# EasyEDA Pro project AcRemote.eprj

# Schematic Schematic1
Create Date: 2023-08-15; Page Name: P1; Project Name: AcRemote; Schematic Name: Schematic1; Update Date: 2023-08-17; Company: EasyEDA.com; Drawed: EasyEDA Pro; Page Size: A4; Part Number: JLCPCB-002; Reviewed: EasyEDA Pro; Version: V0.1
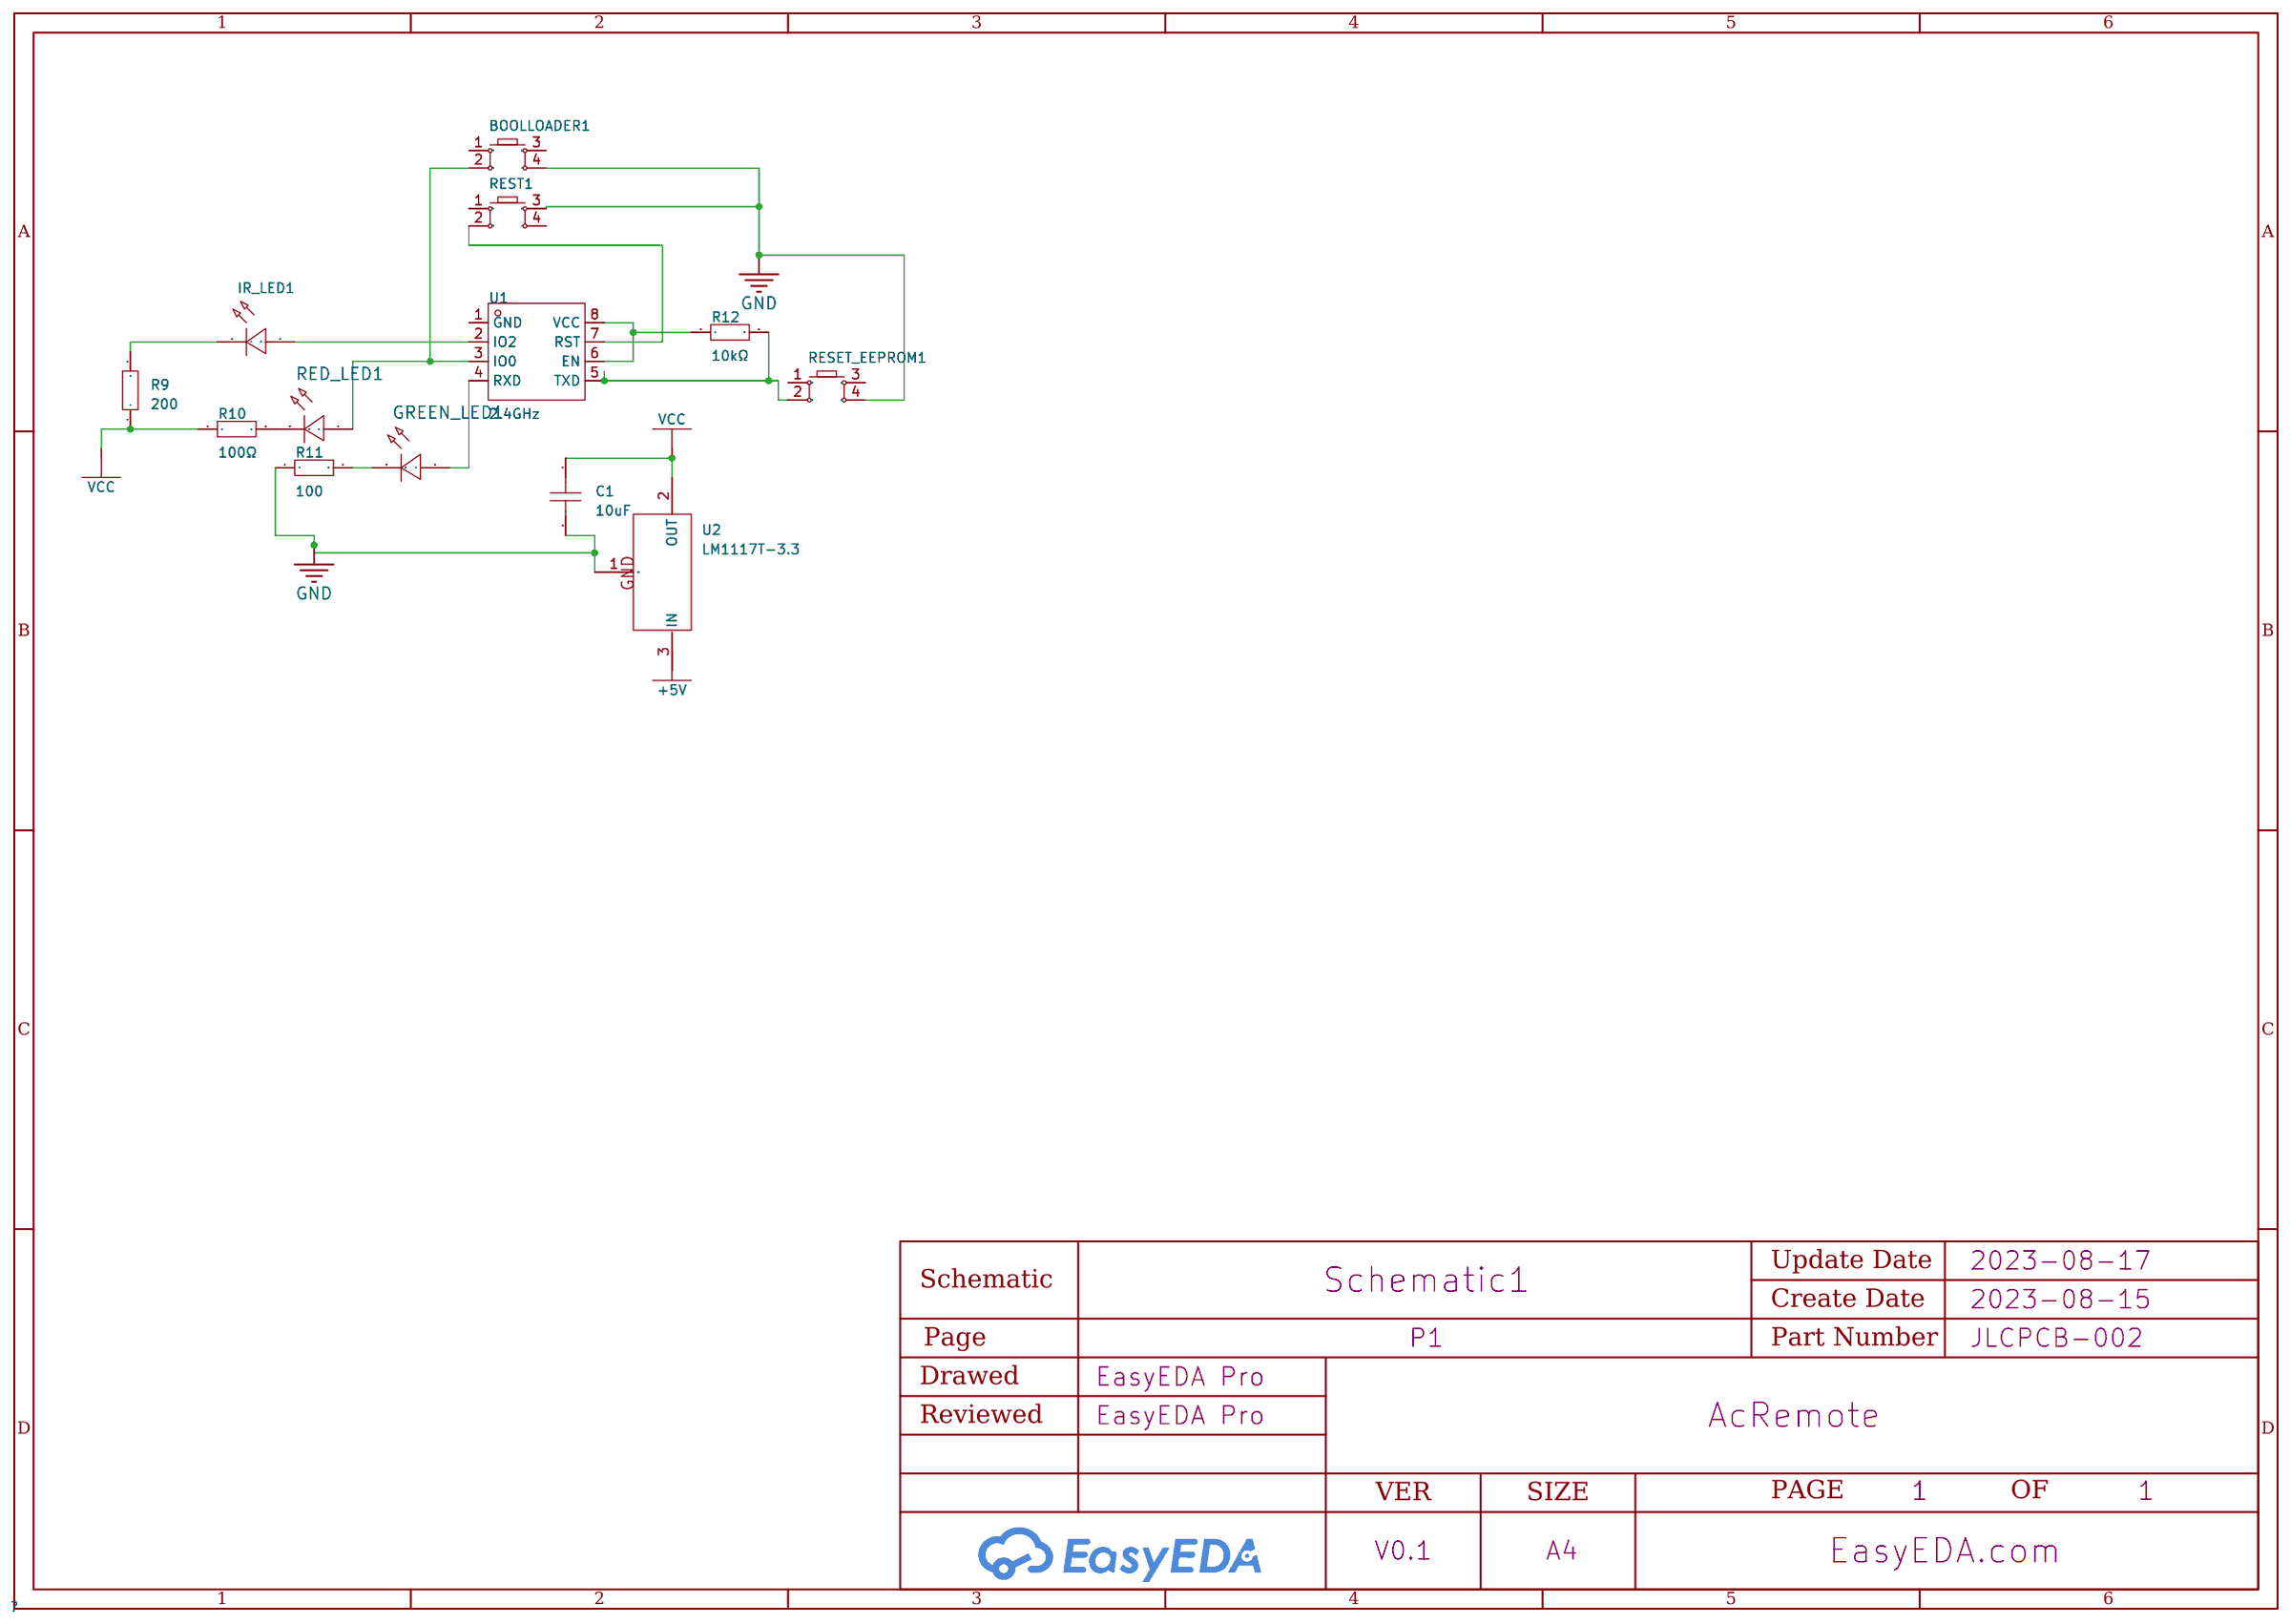
[diagram p0: schematic sheet]

## Parts
BOOLLOADER1  -  [KEY-TH_4P-L6.0-W6.0-P3.90-LS6.5]
C1  10uF  [C0201]
GREEN_LED1  -  [LED0402-RD_YELLOW]
IR_LED1  -  [LED-TH_BD3.0-P2.54-FD]
R9  200  [RES-TH_BD1.8-L3.2-P7.20-D0.4]
R10  100Ω  [RES-TH_BD1.8-L3.2-P7.20-D0.4]
R11  100  [RES-TH_BD1.8-L3.2-P7.20-D0.4]
R12  10kΩ  [RES-TH_BD1.8-L3.2-P7.20-D0.4]
RED_LED1  -  [LED0402-RD_YELLOW]
RESET_EEPROM1  -  [KEY-TH_4P-L6.0-W6.0-P3.90-LS6.5]
REST1  -  [KEY-TH_4P-L6.0-W6.0-P3.90-LS6.5]
U1  2.4GHz  [WIFIM-TH_8P-L24.7-W14.4-P2.54]
U2  LM1117T-3.3  [TO-220-3_L10.0-W4.5-P2.54-L]

## Library data of the parts
BOOLLOADER1 RESET_EEPROM1 REST1 = Key_TH_6x6x4.5: Supplier Footprint: Through
C1 = CAP_0201: Supplier Footprint: 0201
GREEN_LED1 RED_LED1 = LED_0402-R: Supplier Footprint: 0402
IR_LED1 = LED_TH-R_3mm: Supplier Footprint: Through
R9-R12 = Res_AXIAL-1/8W: Supplier Footprint: Through
U1 = ESP-01S_C503582: Frequency:2.4GHz Output Power:16dBm Output Power:16dBm Core Processor:ESP32 Support Interface:GPIO；UART；PWM Antenna Type:PCB 板载天线 Wireless Standard:802.11b/g/n Operating Voltage:3V~3.6V Operating Voltage:3V~3.6V Receive  Current:56mA Send  Current:170mA S; LCSC Part Name: 完整的802.11b/g/nWi-FiSoC模块; Supplier Part: C503582; Manufacturer: Ai-Thinker(安信可); Manufacturer Part: ESP-01S; JLCPCB Part Class: Extended Part; Datasheet: https://atta.szlcsc.com/upload/public/pdf/source/20200407/C503582_1139AF8FB42E05635FA0089E1752A536.pdf; Supplier: LCSC; Output Power: 16dBm; Core Processor: ESP32; Support Interface: GPIO；UART；PWM; Antenna Type: PCB 板载天线; Wireless Standard: 802.11b/g/n; Operating Voltage: 3V~3.6V; Receive  Current: 56mA; Send  Current: 170mA; Sensitivity: -90dBm; Operating Temperature: -20℃~+70℃
U2 = LM1117T-3.3: Output Type:-; Supplier Part: C498321; Manufacturer: HGSEMI(华冠); Supplier Footprint: TO-220; JLCPCB Part Class: Extended Part; Datasheet: https://atta.szlcsc.com/upload/public/pdf/source/20201010/C498321_A78C1BC049E2A9ED534DA1D4E5758433.pdf; Supplier: LCSC

## Nets
+5V: U2.3(IN)
GND: BOOLLOADER1.4 C1.2 R11.1 RESET_EEPROM1.4 REST1.3 U2.1(GND)
VCC: C1.1 R9.1 R10.1 U2.2(OUT)
Net-(BOOLLOADER1-2): BOOLLOADER1.2 RED_LED1.1(A) U1.3(IO0)
Net-(GREEN_LED1-1): GREEN_LED1.1(A) U1.4(RXD)
Net-(GREEN_LED1-2): GREEN_LED1.2(C) R11.2
Net-(IR_LED1-1): IR_LED1.1(C) U1.2(IO2)
Net-(IR_LED1-2): IR_LED1.2(A) R9.2
Net-(R10-2): R10.2 RED_LED1.2(C)
Net-(R12-1): R12.1 U1.6(EN) U1.8(VCC)
Net-(R12-2): R12.2 RESET_EEPROM1.2 U1.5(TXD)
Net-(REST1-2): REST1.2 U1.7(RST)

Not connected (* = marked no-connect by the designer): BOOLLOADER1 1 3; RESET_EEPROM1 1 3; REST1 1 4; U1 1(GND)

# Schematic Schematic2
Create Date: 2023-10-16; Page Name: P1; Project Name: AcRemote; Schematic Name: Schematic2; Update Date: 2023-10-21; Company: EasyEDA.com; Drawed: EasyEDA Pro; Page Size: A4; Part Number: JLCPCB-002; Reviewed: EasyEDA Pro; Version: V0.1
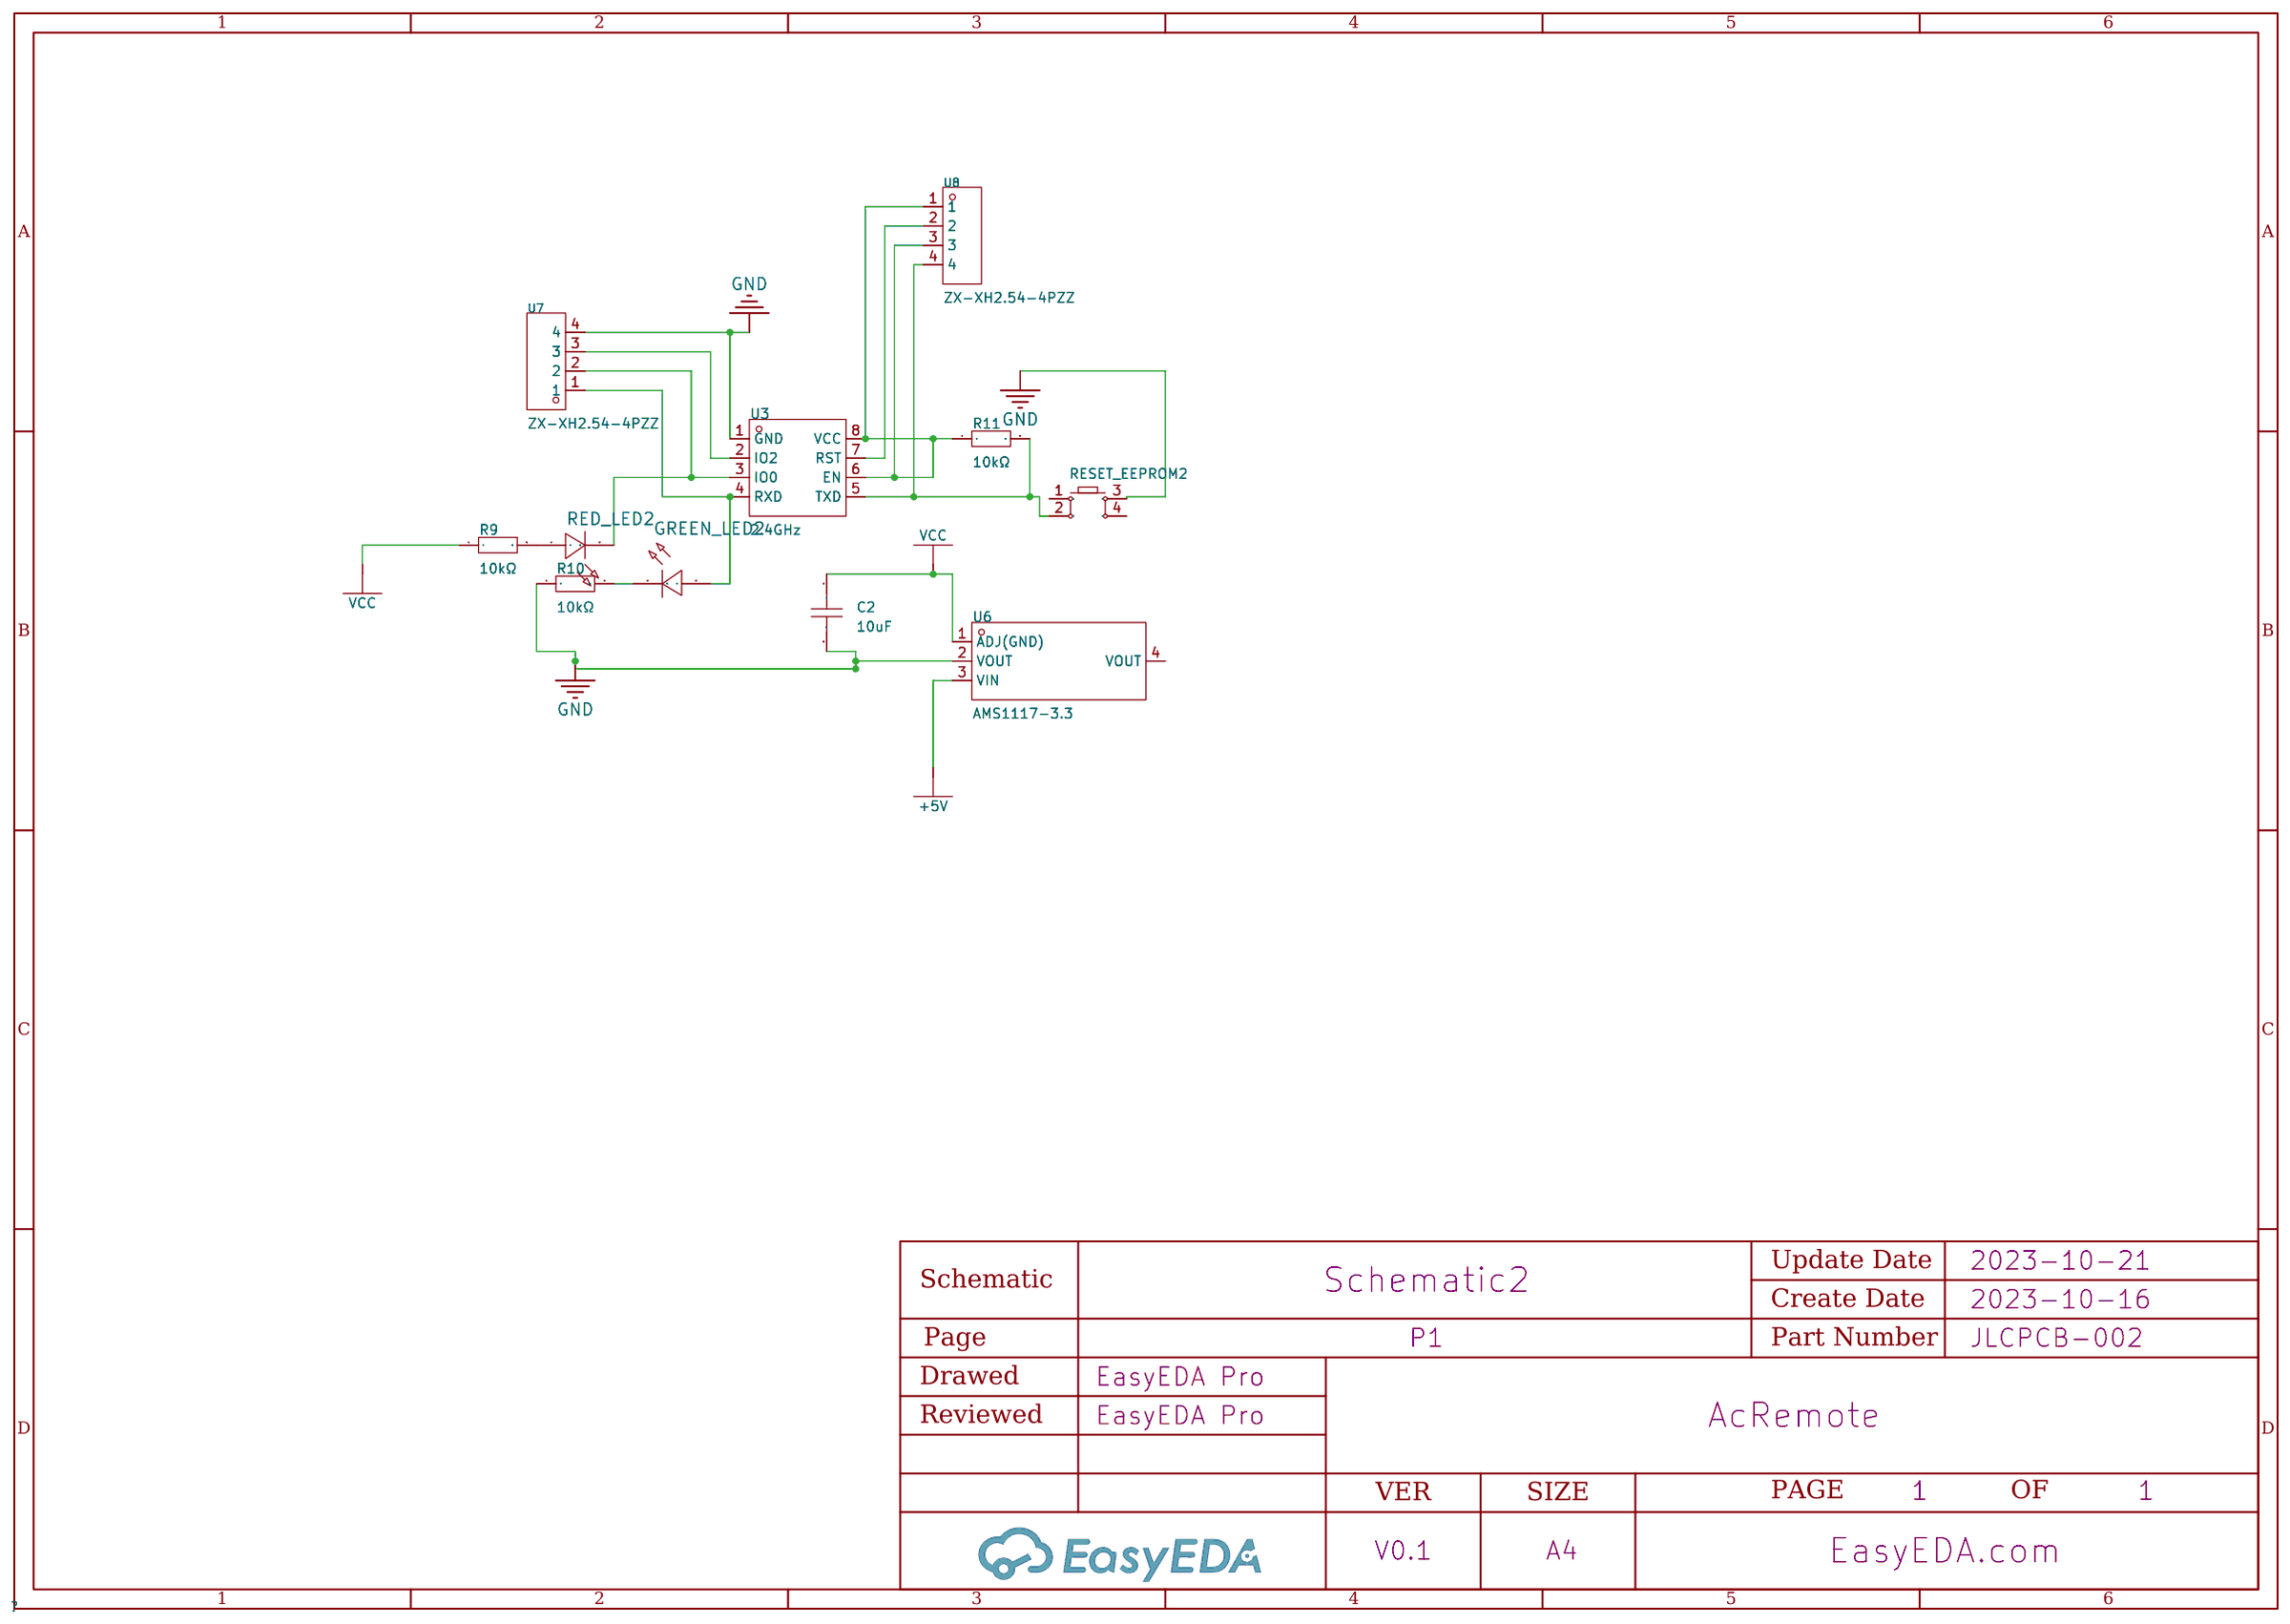
[diagram p1: schematic sheet]

## Parts
C2  10uF  [CAP-TH_BD4.0-P2.50-D0.6-FD]
GREEN_LED2  -  [LED-TH_BD6.0-P2.54_UV415J25X-5]
R9  10kΩ  [R_AXIAL-0.4]
R10  10kΩ  [R_AXIAL-0.4]
R11  10kΩ  [R_AXIAL-0.4]
RED_LED2  -  [LED-TH_BD6.0-P2.54_UV415J25X-5]
RESET_EEPROM2  -  [KEY-TH_4P-L6.0-W6.0-P3.90-LS6.5]
U3  2.4GHz  [WIFIM-TH_8P-L24.7-W14.4-P2.54]
U6  AMS1117-3.3  [SOT-223-3_L6.5-W3.4-P2.30-LS7.0-BR]
U7  ZX-XH2.54-4PZZ  [CONN-TH_4P-P2.50_4PIN]
U8  ZX-XH2.54-4PZZ  [CONN-TH_4P-P2.50_4PIN]

## Library data of the parts
C2 = CAP_0201: Supplier Footprint: 0201
GREEN_LED2 RED_LED2 = LED_0402-R: Supplier Footprint: 0402
R9-R11 = Res_AXIAL-1/4W: Supplier Footprint: Through
RESET_EEPROM2 = Key_TH_6x6x4.5: Supplier Footprint: Through
U3 = ESP-01S_C503582: Frequency:2.4GHz Output Power:16dBm Output Power:16dBm Core Processor:ESP32 Support Interface:GPIO；UART；PWM Antenna Type:PCB 板载天线 Wireless Standard:802.11b/g/n Operating Voltage:3V~3.6V Operating Voltage:3V~3.6V Receive  Current:56mA Send  Current:170mA S; LCSC Part Name: 完整的802.11b/g/nWi-FiSoC模块; Supplier Part: C503582; Manufacturer: Ai-Thinker(安信可); Manufacturer Part: ESP-01S; JLCPCB Part Class: Extended Part; Datasheet: https://atta.szlcsc.com/upload/public/pdf/source/20200407/C503582_1139AF8FB42E05635FA0089E1752A536.pdf; Supplier: LCSC; Output Power: 16dBm; Core Processor: ESP32; Support Interface: GPIO；UART；PWM; Antenna Type: PCB 板载天线; Wireless Standard: 802.11b/g/n; Operating Voltage: 3V~3.6V; Receive  Current: 56mA; Send  Current: 170mA; Sensitivity: -90dBm; Operating Temperature: -20℃~+70℃
U6 = AMS1117-3.3_C2891839: Output Type: Output Polarity:Positive Number of Outputs:1 Maximum Input Voltage:18V Output Voltage:3.3V~3.3V Output Voltage:3.3V~3.3V Dropout Voltage:1.3V@(1A) Output Current:1A Power Supply Rejection Ratio (PSRR):60dB@(120Hz) Operating Temperature:±150℃@; LCSC Part Name: 正 Vin=18V Vout=3.3V 1A 60dB@(120Hz); Supplier Part: C2891839; Manufacturer: YONGYUTAI(永裕泰); Supplier Footprint: SOT-223-3; JLCPCB Part Class: Extended Part; Datasheet: https://atta.szlcsc.com/upload/public/pdf/source/20210901/A75ADDE6A17DEE0002F2A58A8D1F3634.pdf; Supplier: LCSC; Output Polarity: Positive; Number of Outputs: 1; Maximum Input Voltage: 18V; Output Voltage: 3.3V~3.3V; Dropout Voltage: 1.3V@(1A); Output Current: 1A; Power Supply Rejection Ratio (PSRR): 60dB@(120Hz); Operating Temperature: ±150℃@(Tj)
U7 U8 = ZX-XH2.54-4PZZ: Reference Series:XH Pitch:2.54mm Pins Structure:1x4P Number of Rows:1 Number of PINs Per Row:4 Row Spacing:- Gender:公型插针 Mounting Style:Straight Current Rating (Max):3A Contact Material:Brass Contact Plating:Tin Operating Temperature Range:-25℃~+85℃ Opera; LCSC Part Name: XH 2.54mm 1x4P 直插; Supplier Part: C7429634; Manufacturer: Megastar(兆星); Supplier Footprint: 插件,P=2.54mm; JLCPCB Part Class: Extended Part; Datasheet: https://atta.szlcsc.com/upload/public/pdf/source/20230619/B529A2163E0159A644AB3383D208FB03.pdf; Supplier: LCSC; Reference Series: XH; Pitch: 2.54mm; Pins Structure: 1x4P; Number of Rows: 1; Number of PINs Per Row: 4; Gender: 公型插针; Mounting Style: Straight; Current Rating (Max): 3A; Contact Material: Brass; Contact Plating: Tin; Operating Temperature Range: -25℃~+85℃; Welding Temperature (Max): 260℃

## Nets
+5V: U6.3(VIN)
GND: C2.2 R10.1 RESET_EEPROM2.3 U3.1(GND) U6.2(VOUT) U7.4
VCC: C2.1 R9.1 U6.1(ADJ(GND))
$1N399: GREEN_LED2.2(C) R10.2
$1N1476: R9.2 RED_LED2.1(A)
$1N1781: U3.7(RST) U8.2
$1N1786: R11.1 U3.6(EN) U3.8(VCC) U8.1 U8.3
$1N1799: R11.2 RESET_EEPROM2.2 U3.5(TXD) U8.4
$1N1820: U3.2(IO2) U7.3
$1N1825: RED_LED2.2(C) U3.3(IO0) U7.2
$1N1834: GREEN_LED2.1(A) U3.4(RXD) U7.1

Not connected (* = marked no-connect by the designer): RESET_EEPROM2 1 4; U6 4(VOUT)

# Schematic Schematic2_1
Create Date: 2023-10-16; Page Name: P1; Project Name: AcRemote; Schematic Name: Schematic2; Update Date: 2023-10-19; Company: EasyEDA.com; Drawed: EasyEDA Pro; Page Size: A4; Part Number: JLCPCB-002; Reviewed: EasyEDA Pro; Version: V0.1
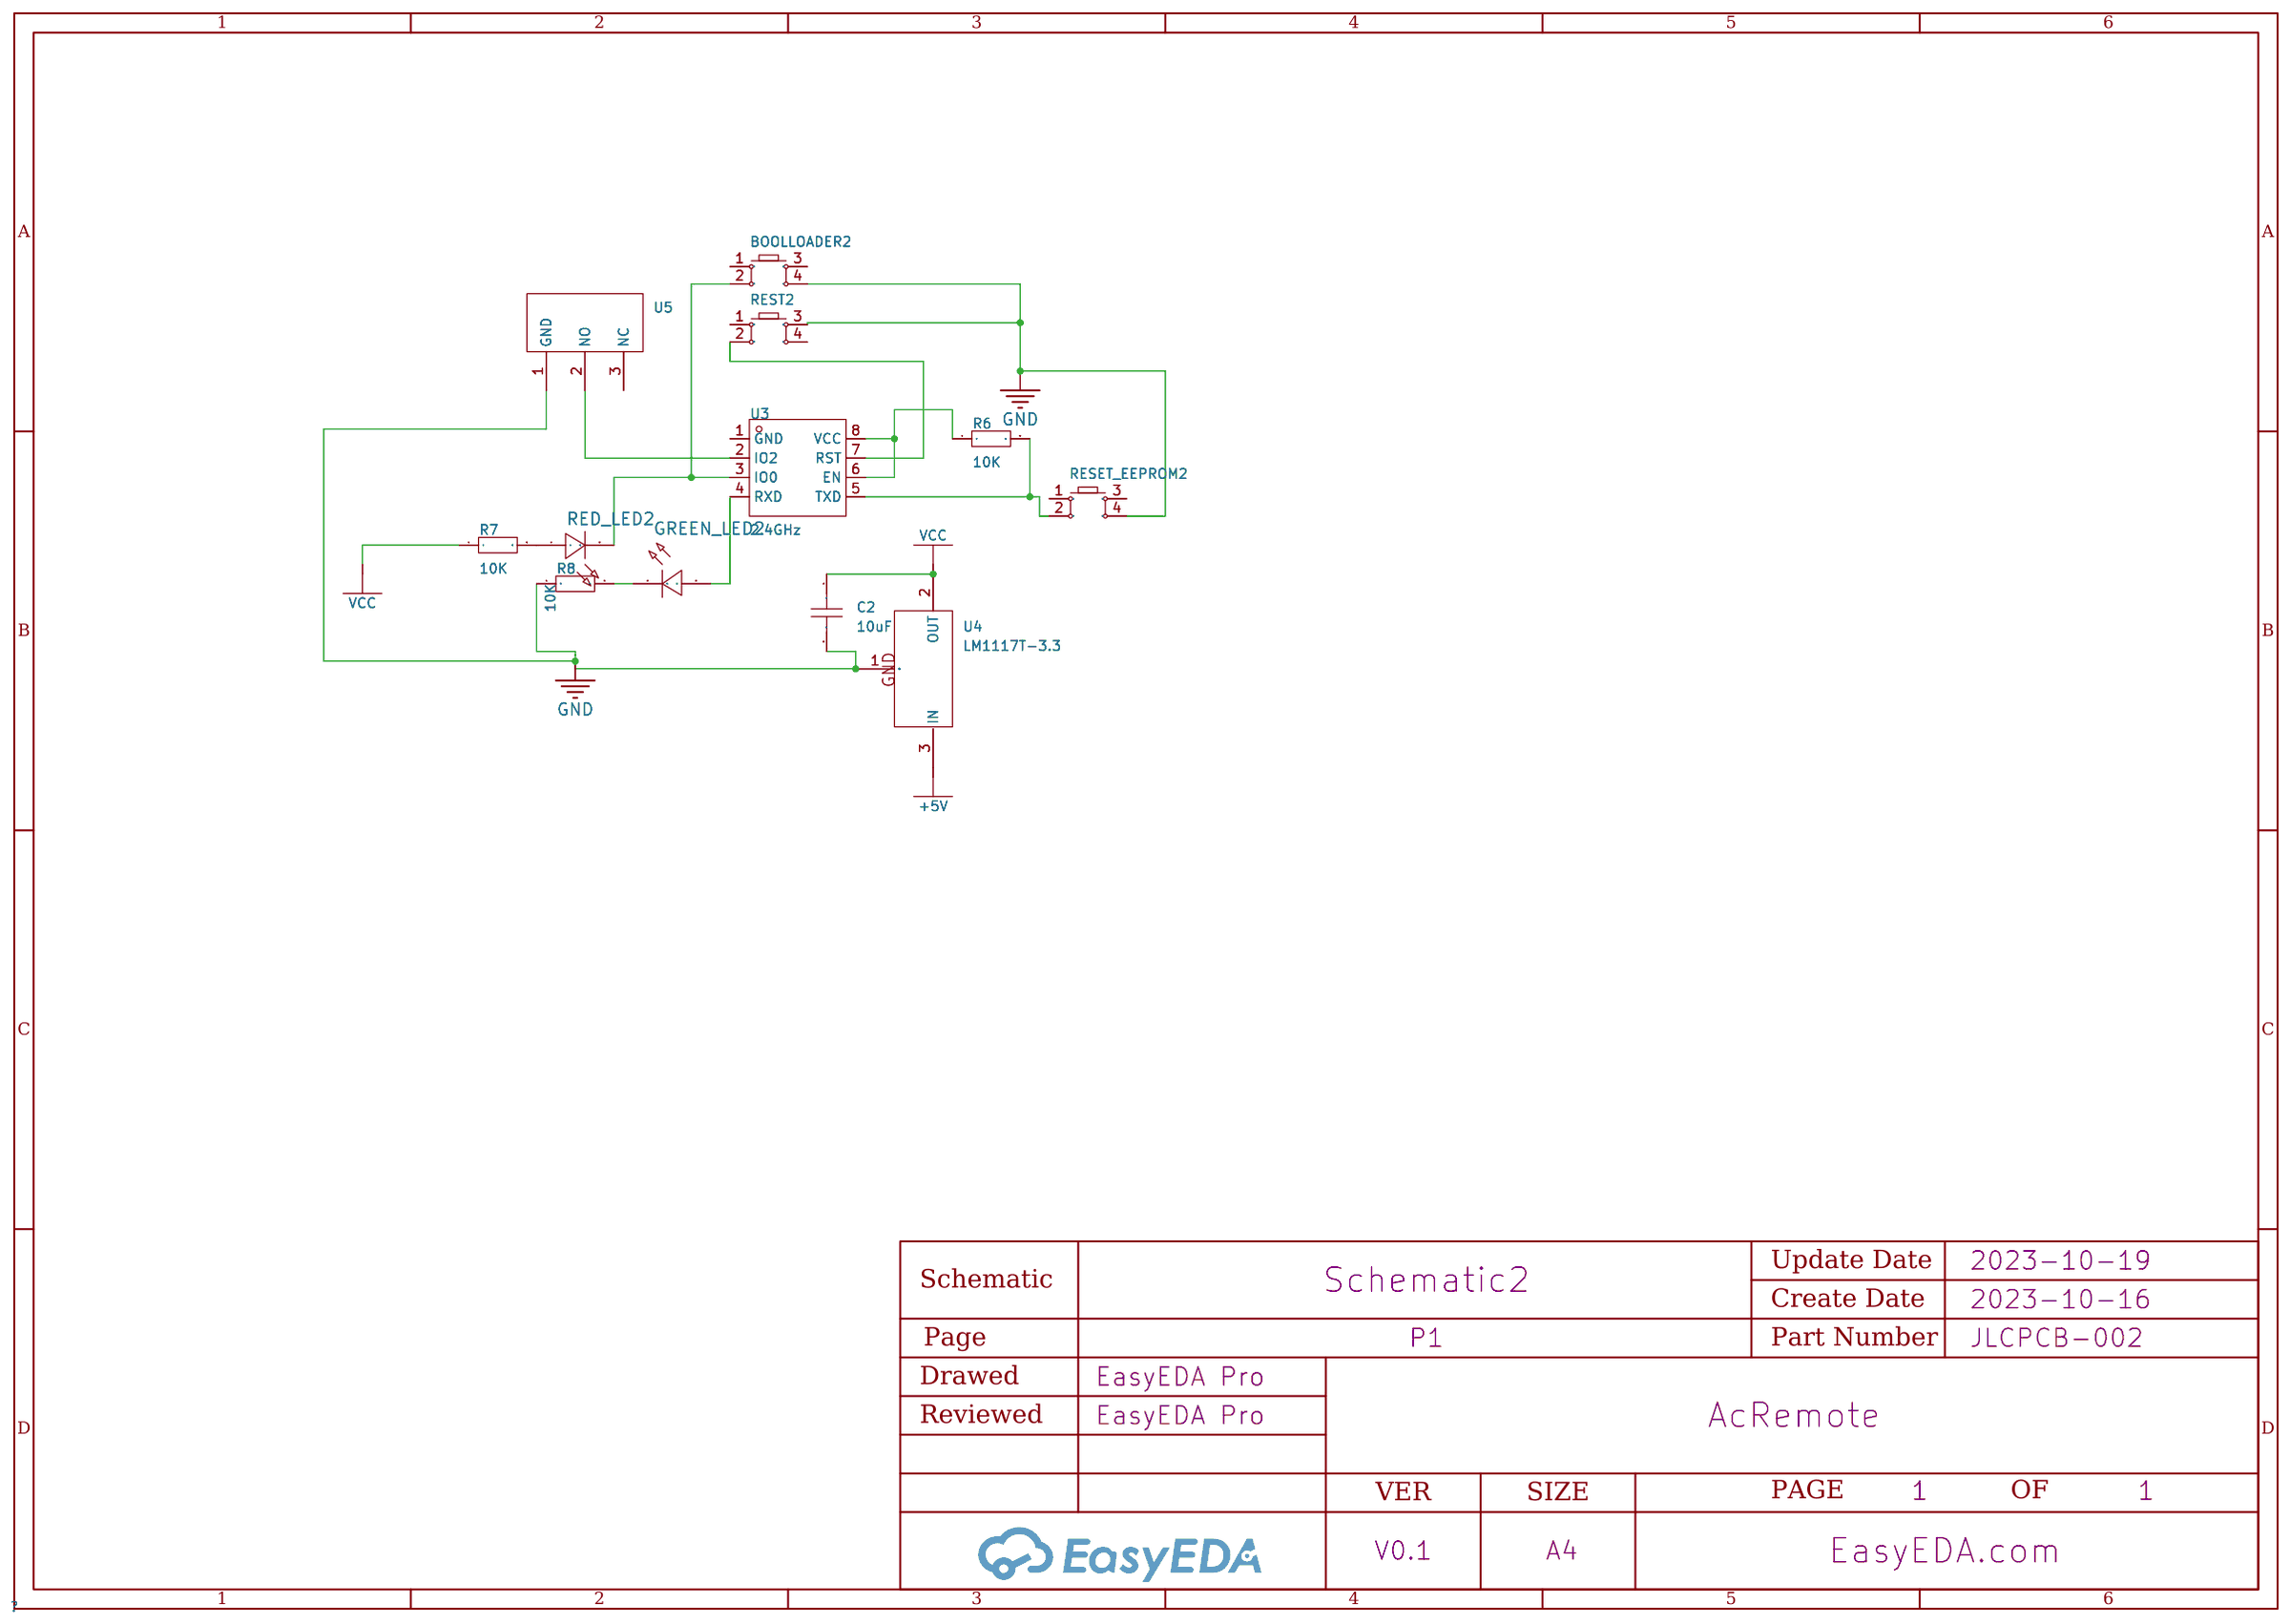
[diagram p2: schematic sheet]

## Parts
BOOLLOADER2  -  [KEY-TH_4P-L6.0-W6.0-P3.90-LS6.5]
C2  10uF  [CAP-TH_BD4.0-P2.50-D0.6-FD]
GREEN_LED2  -  [LED-TH_BD6.0-P2.54_UV415J25X-5]
R6  10K  [RES-TH_BD2.5-L6.8-P10.50-D0.5]
R7  10K  [RES-TH_BD2.5-L6.8-P10.50-D0.5]
R8  10K  [RES-TH_BD2.5-L6.8-P10.50-D0.5]
RED_LED2  -  [LED-TH_BD6.0-P2.54_UV415J25X-5]
RESET_EEPROM2  -  [KEY-TH_4P-L6.0-W6.0-P3.90-LS6.5]
REST2  -  [KEY-TH_4P-L6.0-W6.0-P3.90-LS6.5]
U3  2.4GHz  [WIFIM-TH_8P-L24.7-W14.4-P2.54]
U4  LM1117T-3.3  [TO-220-3_L10.0-W4.5-P2.54-L]
U5  -  [limit switch]

## Library data of the parts
BOOLLOADER2 RESET_EEPROM2 REST2 = Key_TH_6x6x4.5: Supplier Footprint: Through
C2 = CAP_0201: Supplier Footprint: 0201
GREEN_LED2 RED_LED2 = LED_0402-R: Supplier Footprint: 0402
R6-R8 = Res_0603: Supplier Footprint: 0603
U3 = ESP-01S_C503582: Frequency:2.4GHz Output Power:16dBm Output Power:16dBm Core Processor:ESP32 Support Interface:GPIO；UART；PWM Antenna Type:PCB 板载天线 Wireless Standard:802.11b/g/n Operating Voltage:3V~3.6V Operating Voltage:3V~3.6V Receive  Current:56mA Send  Current:170mA S; LCSC Part Name: 完整的802.11b/g/nWi-FiSoC模块; Supplier Part: C503582; Manufacturer: Ai-Thinker(安信可); Manufacturer Part: ESP-01S; JLCPCB Part Class: Extended Part; Datasheet: https://atta.szlcsc.com/upload/public/pdf/source/20200407/C503582_1139AF8FB42E05635FA0089E1752A536.pdf; Supplier: LCSC; Output Power: 16dBm; Core Processor: ESP32; Support Interface: GPIO；UART；PWM; Antenna Type: PCB 板载天线; Wireless Standard: 802.11b/g/n; Operating Voltage: 3V~3.6V; Receive  Current: 56mA; Send  Current: 170mA; Sensitivity: -90dBm; Operating Temperature: -20℃~+70℃
U4 = LM1117T-3.3: Output Type:-; Supplier Part: C498321; Manufacturer: HGSEMI(华冠); Supplier Footprint: TO-220; JLCPCB Part Class: Extended Part; Datasheet: https://atta.szlcsc.com/upload/public/pdf/source/20201010/C498321_A78C1BC049E2A9ED534DA1D4E5758433.pdf; Supplier: LCSC
U5 = limit switch

## Nets
+5V: U4.3(IN)
GND: BOOLLOADER2.4 C2.2 R8.1 RESET_EEPROM2.4 REST2.3 U4.1(GND) U5.1(GND)
VCC: C2.1 R7.1 U4.2(OUT)
$1N397: REST2.2 U3.7(RST)
$1N398: GREEN_LED2.1(A) U3.4(RXD)
$1N399: GREEN_LED2.2(C) R8.2
$1N400: R6.1 U3.6(EN) U3.8(VCC)
$1N401: R6.2 RESET_EEPROM2.2 U3.5(TXD)
$1N410: U3.2(IO2) U5.2(NO)
$1N635: R7.2 RED_LED2.1(A)
$1N639: BOOLLOADER2.2 RED_LED2.2(C) U3.3(IO0)

Not connected (* = marked no-connect by the designer): BOOLLOADER2 1 3; RESET_EEPROM2 1 3; REST2 1 4; U3 1(GND); U5 3(NC)

# Board PCB5
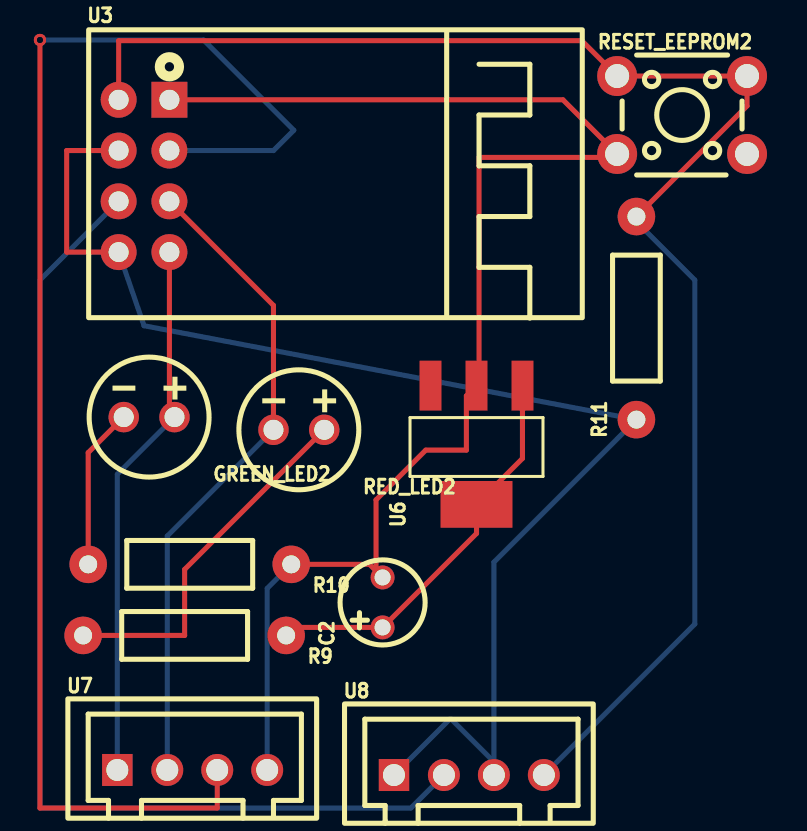
[diagram p3: board, top side]
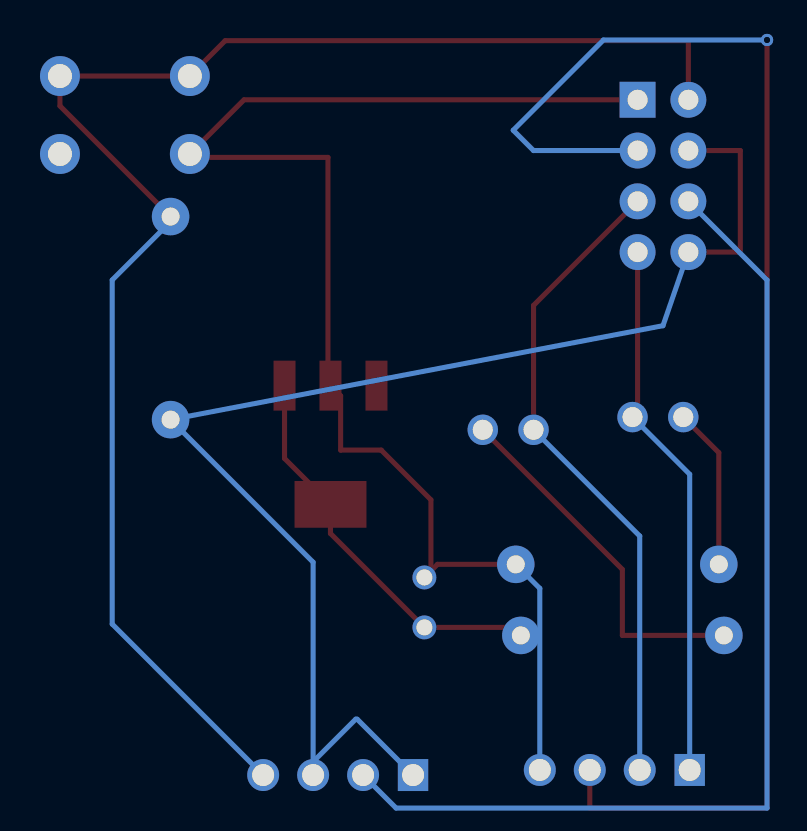
[diagram p4: board, bottom side, seen from below]

No outline. copper layers: Top Layer, Bottom Layer. Coordinates in mm from the lowest, leftmost part position.
Stack: Top Layer 0.035mm / Dielectric1 1.51mm FR4 er 4.5 / Bottom Layer 0.035mm

## Design rules (mm)
template: JLCPCB Capability(Two Layers Board)
spacing copperThickness1oz (default): track to track 0.102, other pairs 0.152 to 0.3
spacing copperThickness2oz: track to track 0.203, other pairs 0.152 to 0.3
track width copperThickness1oz (default): min 0.127, default 0.254, max 2.54
track width copperThickness2oz: min 0.203, default 0.254, max 2.54
differential pair differentialPair (default): width min 0.127, default 0.254, max 2.54; gap min 0.152, default 0.152
via viaSize (default): diameter min 0.5, default 0.61, max 10; hole min 0.3, default 0.305, max 6.3

## Placement (name value [footprint] x y rotation side)
C2  10uF  [CAP-TH_BD4.0-P2.50-D0.6-FD]  11.94 8.64 90 top
GREEN_LED2  -  [LED-TH_BD6.0-P2.54_UV415J25X-5]  0.25 17.91 180 top
R9  10kΩ  [R_AXIAL-0.4]  2.03 6.98 180 top
R10  10kΩ  [R_AXIAL-0.4]  2.29 10.54 180 top
R11  10kΩ  [R_AXIAL-0.4]  24.64 22.86 90 top
RED_LED2  -  [LED-TH_BD6.0-P2.54_UV415J25X-5]  7.75 17.27 180 top
RESET_EEPROM2  -  [KEY-TH_4P-L6.0-W6.0-P3.90-LS6.5]  26.92 33.02 0 top
U3  2.4GHz  [WIFIM-TH_8P-L24.7-W14.4-P2.54]  0 29.97 0 top
U6  AMS1117-3.3  [SOT-223-3_L6.5-W3.4-P2.30-LS7.0-BR]  16.64 16.51 90 top
U7  ZX-XH2.54-4PZZ  [CONN-TH_4P-P2.50_4PIN]  2.41 0.25 0 top
U8  ZX-XH2.54-4PZZ  [CONN-TH_4P-P2.50_4PIN]  16.26 0 0 top

## Footprints (pads in the part's own frame, mm; a bottom-side part is the same pattern mirrored in y, then rotated)
CAP-TH_BD4.0-P2.50-D0.6-FD
  round 1.2 hole 0.8: 1(-1.25,0) 2(1.25,0)
CONN-TH_4P-P2.50_4PIN
  rect 1.524x1.6 hole 1.1: 1(-3.75,0)
  round 1.6 hole 1.1: 2(-1.25,0) 3(1.25,0) 4(3.75,0)
KEY-TH_4P-L6.0-W6.0-P3.90-LS6.5
  round 2 hole 1.2: 1(-3.25,1.95) 2(3.25,1.95) 3(-3.25,-1.95) 4(3.25,-1.95)
LED-TH_BD6.0-P2.54_UV415J25X-5
  round 1.524 hole 1: 1(-1.27,0) 2(1.27,0)
R_AXIAL-0.4
  round 1.879 hole 0.899: 1(-5.08,0) 2(5.08,0)
SOT-223-3_L6.5-W3.4-P2.30-LS7.0-BR
  rect 2.5x1.1 smd: 1(2.97,-2.3) 2(2.97,0) 3(2.97,2.3)
  rect 2.34x3.6 smd: 4(-2.97,0)
WIFIM-TH_8P-L24.7-W14.4-P2.54
  rect 1.8x1.8 hole 1: 1(1.27,3.81)
  round 1.8 hole 1: 2(1.27,1.27) 3(1.27,-1.27) 4(1.27,-3.81) 5(-1.27,3.81) 6(-1.27,1.27) 7(-1.27,-1.27) 8(-1.27,-3.81)

## Nets
As in the schematic.

Pads without a net: RESET_EEPROM2 1 4; U6 4

## Via types
v1: diameter 0.61, hole 0.305, Top Layer to Bottom Layer, 2 vias

## Routing (per net, layer and track width the routed paths; a pad name or vN(x,y) marks a point on that pad's centre or on a via; arc(x,y) is an arc through that point)
$1N1820: length 70.4
  Top Layer w0.254: v1(-5.21,36.77) -5.21,-1.65 3.66,-1.65 U7.3
  Bottom Layer w0.254: v1(-5.21,36.77) 2.98,36.77 7.49,32.26 6.48,31.24 U3.2
GND: length 70.1
  Top Layer w0.254: U3.1 20.96,33.78 RESET_EEPROM2.3 23.5,30.9 16.76,30.9 16.76,19.61 U6.2 16.13,18.97 16.13,16.26 14.1,16.26 11.61,13.77 11.61,10.21 ; R10.1 11.28,10.54 C2.2
  Bottom Layer w0.254: R10.1 6.16,9.34 U7.4
VCC: length 20
  Top Layer w0.254: R9.1 7.51,7.39 C2.1 16.64,12.09 16.64,13.54 18.94,15.84 U6.1
$1N399: length 8.1
  Top Layer w0.254: GREEN_LED2.2 -2.79,16.13 R10.2
$1N1476: length 18.3
  Top Layer w0.254: R9.2 2.03,6.98 2.03,10.29 RED_LED2.1
$1N1781: length 52.9
  Bottom Layer w0.254: U3.7 -5.21,24.77 -5.21,-1.65 13.36,-1.65 U8.2
$1N1786: length 67.7
  Top Layer w0.254: U3.6 -3.87,31.24 -3.87,26.16 U3.8
  Bottom Layer w0.254: U3.8 0,22.48 R11.1 17.51,10.65 U8.3 17.51,0.66 15.37,2.79 15.3,2.79 U8.1
$1N1799: length 76.7
  Top Layer w0.254: U3.5 -1.27,36.74 21.91,36.74 23.67,34.97 RESET_EEPROM2.2 30.17,33.48 R11.2
  Bottom Layer w0.254: U8.4 27.56,7.55 27.56,24.77 24.64,27.69 R11.2
$1N1825: length 32.8
  Top Layer w0.254: U3.3 6.48,23.49 RED_LED2.2
  Bottom Layer w0.254: RED_LED2.2 1.16,11.96 U7.2
$1N1834: length 27.2
  Top Layer w0.254: U3.4 1.27,18.16 GREEN_LED2.1
  Bottom Layer w0.254: GREEN_LED2.1 -1.34,15.05 U7.1

# Board PCB5_1
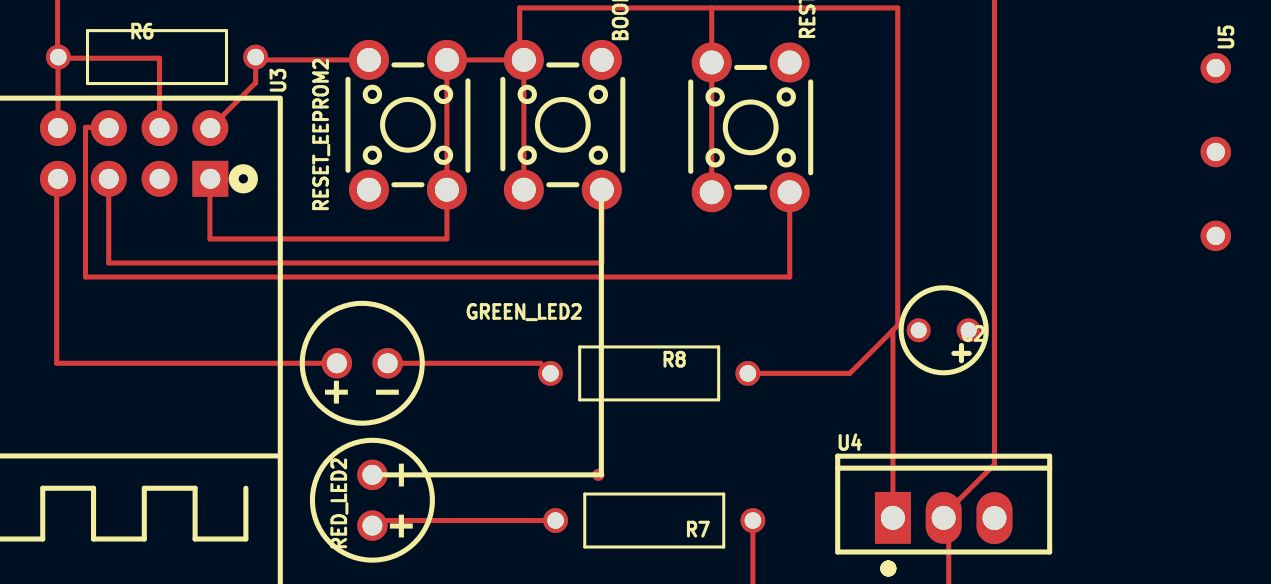
[diagram p5: board, top side]
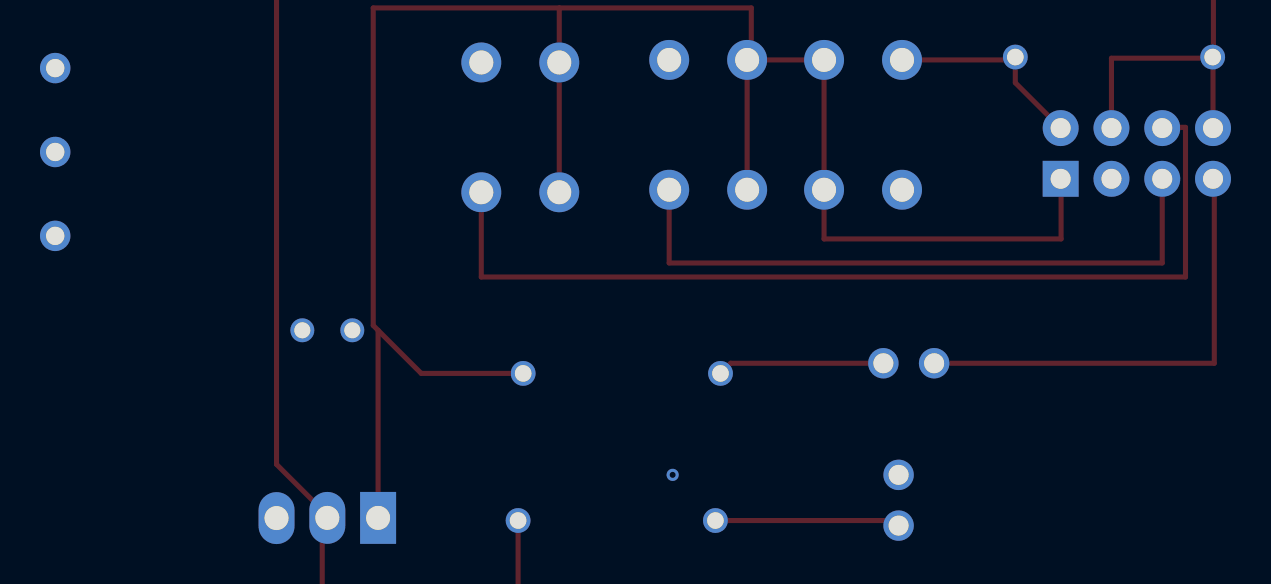
[diagram p6: board, bottom side, seen from below]

No outline. copper layers: Top Layer, Bottom Layer. Coordinates in mm from the lowest, leftmost part position.
Stack: Top Layer 0.035mm / Dielectric1 1.51mm FR4 er 4.5 / Bottom Layer 0.035mm

## Design rules (mm)
template: JLCPCB Capability(Two Layers Board)
spacing copperThickness1oz (default): track to track 0.102, other pairs 0.152 to 0.3
spacing copperThickness2oz: track to track 0.203, other pairs 0.152 to 0.3
track width copperThickness1oz (default): min 0.127, default 0.254, max 2.54
track width copperThickness2oz: min 0.203, default 0.254, max 2.54
differential pair differentialPair (default): width min 0.127, default 0.254, max 2.54; gap min 0.152, default 0.152
via viaSize (default): diameter min 0.5, default 0.61, max 10; hole min 0.3, default 0.305, max 6.3

## Placement (name value [footprint] x y rotation side)
BOOLLOADER2  -  [KEY-TH_4P-L6.0-W6.0-P3.90-LS6.5]  21.44 19.81 270 top
C2  10uF  [CAP-TH_BD4.0-P2.50-D0.6-FD]  40.49 9.53 180 top
GREEN_LED2  -  [LED-TH_BD6.0-P2.54_UV415J25X-5]  11.41 7.87 0 top
R6  10K  [RES-TH_BD2.5-L6.8-P10.50-D0.5]  1.14 23.2 0 top
R7  10K  [RES-TH_BD2.5-L6.8-P10.50-D0.5]  26.01 0 180 top
R8  10K  [RES-TH_BD2.5-L6.8-P10.50-D0.5]  25.76 7.37 180 top
RED_LED2  -  [LED-TH_BD6.0-P2.54_UV415J25X-5]  11.92 1.02 90 top
RESET_EEPROM2  -  [KEY-TH_4P-L6.0-W6.0-P3.90-LS6.5]  13.7 19.81 90 top
REST2  -  [KEY-TH_4P-L6.0-W6.0-P3.90-LS6.5]  30.84 19.69 270 top
U3  2.4GHz  [WIFIM-TH_8P-L24.7-W14.4-P2.54]  0 18.38 270 top
U4  LM1117T-3.3  [TO-220-3_L10.0-W4.5-P2.54-L]  40.49 0.13 0 top
U5  -  [limit switch]  54.36 23.03 270 top

## Footprints (pads in the part's own frame, mm; a bottom-side part is the same pattern mirrored in y, then rotated)
CAP-TH_BD4.0-P2.50-D0.6-FD
  round 1.2 hole 0.8: 1(-1.25,0) 2(1.25,0)
KEY-TH_4P-L6.0-W6.0-P3.90-LS6.5
  round 2 hole 1.2: 1(-3.25,1.95) 2(3.25,1.95) 3(-3.25,-1.95) 4(3.25,-1.95)
LED-TH_BD6.0-P2.54_UV415J25X-5
  round 1.524 hole 1: 1(-1.27,0) 2(1.27,0)
limit switch
  round 1.524 hole 0.914: 1(0.381,-0.254) 2(4.581,-0.254) 3(8.781,-0.254)
RES-TH_BD2.5-L6.8-P10.50-D0.5
  round 1.245 hole 0.83: 1(-4.935,0) 2(4.935,0)
TO-220-3_L10.0-W4.5-P2.54-L
  rect 1.8x2.6 hole 1.2: 1(-2.54,0.005)
  oval 1.8x2.6 hole 1.2: 2(0,0.005) 3(2.54,-0.005)
WIFIM-TH_8P-L24.7-W14.4-P2.54
  rect 1.8x1.8 hole 1: 1(1.27,3.81)
  round 1.8 hole 1: 2(1.27,1.27) 3(1.27,-1.27) 4(1.27,-3.81) 5(-1.27,3.81) 6(-1.27,1.27) 7(-1.27,-1.27) 8(-1.27,-3.81)

## Nets
As in the schematic.

Pads without a net: BOOLLOADER2 1 3; RESET_EEPROM2 1 3; REST2 1 4; U3 1; U5 3

## Via types
v1: diameter 0.61, hole 0.305, Top Layer to Bottom Layer, 4 vias

## Routing (per net, layer and track width the routed paths; a pad name or vN(x,y) marks a point on that pad's centre or on a via; arc(x,y) is an arc through that point)
$1N639: length 32.5
  Top Layer w0.254: U3.3 -1.27,12.9 23.39,12.9 v1(23.39,16.56)
  vias: v1(11.92,2.29) v1(23.22,2.29)
GND: length 98.9
  Top Layer w0.254: 3.81,17.11 3.79,17.09 3.79,14.1 15.65,14.1 15.65,16.56 RESET_EEPROM2.4 19.49,23.06 ; 19.49,23.06 19.28,23.27 19.28,25.66 28.89,25.66 ; 19.49,23.06 BOOLLOADER2.4 ; 28.89,25.66 38.2,25.66 38.2,9.77 37.95,9.53 ; 28.89,25.66 REST2.3 28.89,16.44 ; R8.1 35.79,7.37 37.95,9.53 ; 37.95,9.53 37.95,0
VCC: length 101.4
  Top Layer w0.254: -3.79,23.2 -3.83,23.24 -3.83,28.75 43.03,28.75 43.03,2.81 40.49,0.27 ; R7.1 30.95,-4.74 30.99,-4.7 40.75,-4.7 40.75,-0.12 40.49,0.13
$1N397: length 48.1
  Top Layer w0.254: U3.7 -1.31,19.69 -2.43,19.69 -2.43,12.19 32.79,12.19 REST2.2
$1N398: length 23.3
  Top Layer w0.254: U3.4 -3.87,17.04 -3.87,7.87 GREEN_LED2.1
$1N399: length 8.4
  Top Layer w0.254: GREEN_LED2.2 20.32,7.87 R8.2
$1N400: length 12.1
  Top Layer w0.254: U3.8 -3.81,23.15 1.27,23.15 U3.6
$1N401: length 10.2
  Top Layer w0.254: U3.5 6.08,21.92 6.08,23.2 6.22,23.06 11.75,23.06
$1N635: length 9.3
  Top Layer w0.254: RED_LED2.1 12.17,0 R7.2
